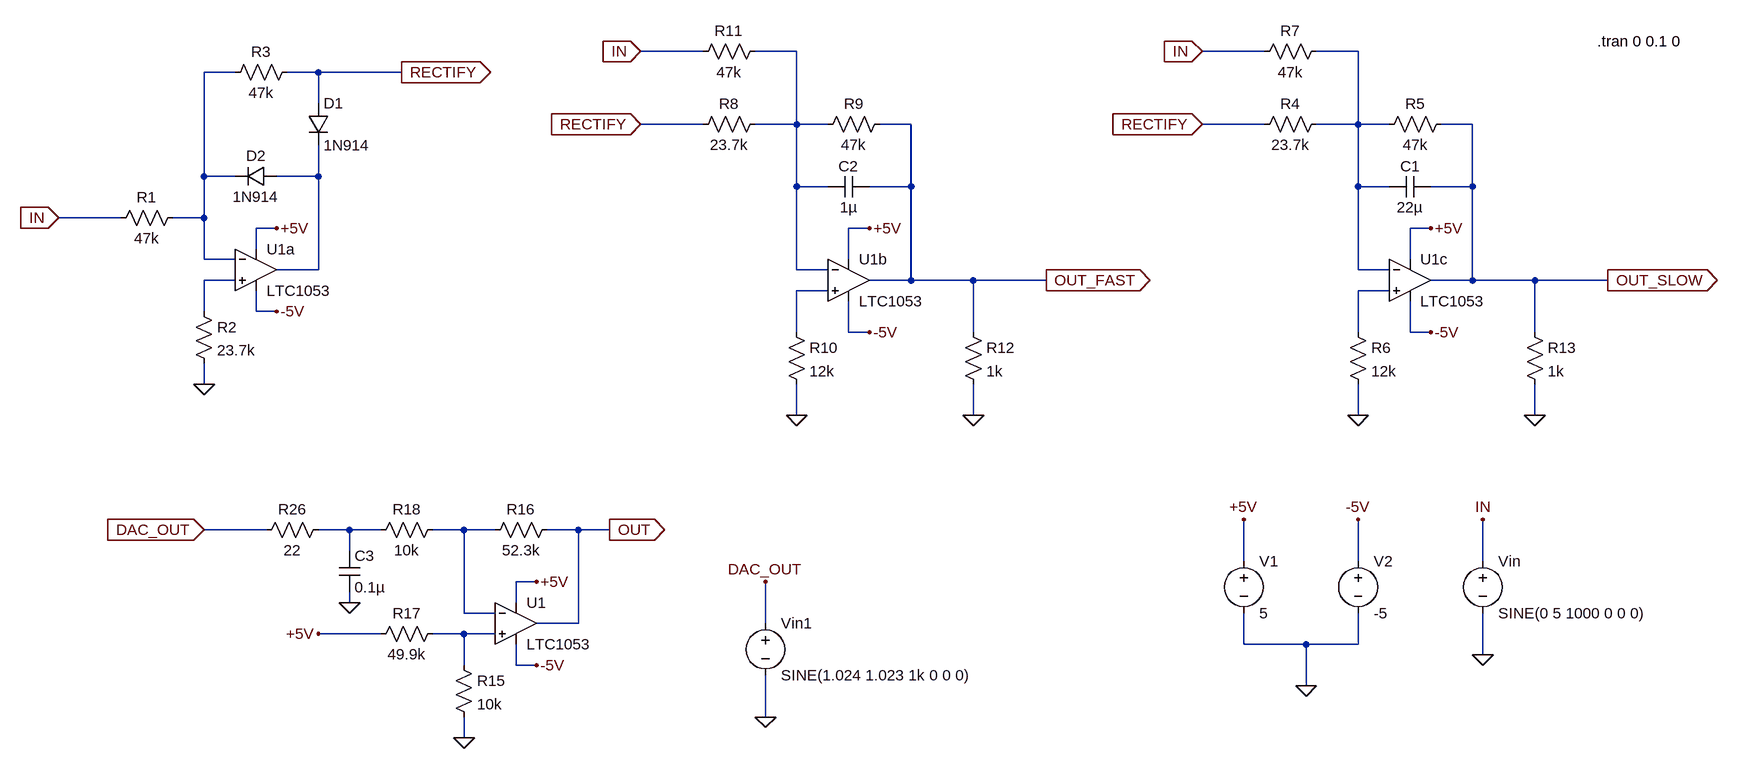
[diagram p0: schematic EE5314_Fall_2016_Project.asc]
EE5314_Fall_2016_Project.asc, the LTspice schematic file:
Version 4
SHEET 1 2136 788
WIRE -192 -336 -288 -336
WIRE -48 -336 -112 -336
WIRE 672 -336 576 -336
WIRE 816 -336 752 -336
WIRE -912 -304 -960 -304
WIRE -784 -304 -832 -304
WIRE -656 -304 -784 -304
WIRE -784 -256 -784 -304
WIRE -192 -224 -288 -224
WIRE -48 -224 -48 -336
WIRE -48 -224 -112 -224
WIRE 0 -224 -48 -224
WIRE 128 -224 80 -224
WIRE 672 -224 576 -224
WIRE 816 -224 816 -336
WIRE 816 -224 752 -224
WIRE 864 -224 816 -224
WIRE 992 -224 944 -224
WIRE -960 -144 -960 -304
WIRE -912 -144 -960 -144
WIRE -784 -144 -784 -192
WIRE -784 -144 -848 -144
WIRE -48 -128 -48 -224
WIRE 0 -128 -48 -128
WIRE 128 -128 128 -224
WIRE 128 -128 64 -128
WIRE 816 -128 816 -224
WIRE 864 -128 816 -128
WIRE 992 -128 992 -224
WIRE 992 -128 928 -128
WIRE -1088 -80 -1184 -80
WIRE -960 -80 -960 -144
WIRE -960 -80 -1008 -80
WIRE -848 -64 -880 -64
WIRE 64 -64 32 -64
WIRE 928 -64 896 -64
WIRE -880 -32 -880 -64
WIRE -960 -16 -960 -80
WIRE -912 -16 -960 -16
WIRE 32 -16 32 -64
WIRE 896 -16 896 -64
WIRE -784 0 -784 -144
WIRE -784 0 -848 0
WIRE -48 0 -48 -128
WIRE 0 0 -48 0
WIRE 816 0 816 -128
WIRE 864 0 816 0
WIRE -912 16 -960 16
WIRE 128 16 128 -128
WIRE 128 16 64 16
WIRE 224 16 128 16
WIRE 336 16 224 16
WIRE 992 16 992 -128
WIRE 992 16 928 16
WIRE 1088 16 992 16
WIRE 1200 16 1088 16
WIRE 0 32 -48 32
WIRE 864 32 816 32
WIRE -960 64 -960 16
WIRE -880 64 -880 32
WIRE -848 64 -880 64
WIRE -48 96 -48 32
WIRE 32 96 32 48
WIRE 64 96 32 96
WIRE 224 96 224 16
WIRE 816 96 816 32
WIRE 896 96 896 48
WIRE 928 96 896 96
WIRE 1088 96 1088 16
WIRE -960 176 -960 144
WIRE -48 224 -48 176
WIRE 224 224 224 176
WIRE 816 224 816 176
WIRE 1088 224 1088 176
WIRE -864 400 -960 400
WIRE -736 400 -784 400
WIRE -688 400 -736 400
WIRE -560 400 -608 400
WIRE -512 400 -560 400
WIRE -384 400 -432 400
WIRE -336 400 -384 400
WIRE -736 432 -736 400
WIRE 640 448 640 384
WIRE 816 448 816 384
WIRE 1008 448 1008 384
WIRE -448 480 -480 480
WIRE -736 512 -736 496
WIRE -480 512 -480 480
WIRE -560 528 -560 400
WIRE -512 528 -560 528
WIRE -384 544 -384 400
WIRE -384 544 -448 544
WIRE -96 544 -96 480
WIRE -688 560 -784 560
WIRE -560 560 -608 560
WIRE -512 560 -560 560
WIRE 640 576 640 528
WIRE 736 576 640 576
WIRE 816 576 816 528
WIRE 816 576 736 576
WIRE 1008 592 1008 528
WIRE -560 608 -560 560
WIRE -480 608 -480 576
WIRE -448 608 -480 608
WIRE 736 640 736 576
WIRE -96 688 -96 624
WIRE -560 720 -560 688
FLAG -1184 -80 IN
IOPIN -1184 -80 In
FLAG -960 176 0
FLAG -848 -64 +5V
FLAG -848 64 -5V
FLAG 640 384 +5V
FLAG 816 384 -5V
FLAG 736 640 0
FLAG 1008 592 0
FLAG 1008 384 IN
FLAG 336 16 OUT_FAST
IOPIN 336 16 Out
FLAG 64 -64 +5V
FLAG 64 96 -5V
FLAG -48 224 0
FLAG -288 -336 IN
IOPIN -288 -336 In
FLAG -288 -224 RECTIFY
IOPIN -288 -224 In
FLAG -656 -304 RECTIFY
IOPIN -656 -304 Out
FLAG 1200 16 OUT_SLOW
IOPIN 1200 16 Out
FLAG 928 -64 +5V
FLAG 928 96 -5V
FLAG 816 224 0
FLAG 576 -336 IN
IOPIN 576 -336 In
FLAG 576 -224 RECTIFY
IOPIN 576 -224 In
FLAG 224 224 0
FLAG 1088 224 0
FLAG -560 720 0
FLAG -448 480 +5V
FLAG -448 608 -5V
FLAG -336 400 OUT
IOPIN -336 400 Out
FLAG -96 688 0
FLAG -96 480 DAC_OUT
FLAG -784 560 +5V
FLAG -960 400 DAC_OUT
IOPIN -960 400 In
FLAG -736 512 0
SYMBOL res -992 -96 R90
WINDOW 0 0 56 VBottom 2
WINDOW 3 32 56 VTop 2
SYMATTR InstName R1
SYMATTR Value 47k
SYMBOL res -976 48 R0
SYMATTR InstName R2
SYMATTR Value 23.7k
SYMBOL diode -848 -160 R90
WINDOW 0 0 32 VBottom 2
WINDOW 3 32 32 VTop 2
SYMATTR InstName D2
SYMATTR Value 1N914
SYMBOL diode -800 -256 R0
SYMATTR InstName D1
SYMATTR Value 1N914
SYMBOL res -816 -320 R90
WINDOW 0 0 56 VBottom 2
WINDOW 3 32 56 VTop 2
SYMATTR InstName R3
SYMATTR Value 47k
SYMBOL voltage 640 432 R0
WINDOW 123 0 0 Left 2
WINDOW 39 0 0 Left 2
SYMATTR InstName V1
SYMATTR Value 5
SYMBOL voltage 816 432 R0
WINDOW 123 0 0 Left 2
WINDOW 39 0 0 Left 2
SYMATTR InstName V2
SYMATTR Value -5
SYMBOL voltage 1008 432 R0
WINDOW 39 24 117 Left 2
SYMATTR InstName Vin
SYMATTR Value SINE(0 5 1000 0 0 0)
SYMATTR Value2 AC 0 0
SYMBOL Opamps\\LTC1053 -880 -64 R0
SYMATTR InstName U1a
SYMBOL cap 64 -144 R90
WINDOW 0 0 32 VBottom 2
WINDOW 3 32 32 VTop 2
SYMATTR InstName C2
SYMATTR Value 1µ
SYMBOL res -96 -240 R90
WINDOW 0 0 56 VBottom 2
WINDOW 3 32 56 VTop 2
SYMATTR InstName R8
SYMATTR Value 23.7k
SYMBOL res 96 -240 R90
WINDOW 0 0 56 VBottom 2
WINDOW 3 32 56 VTop 2
SYMATTR InstName R9
SYMATTR Value 47k
SYMBOL res -64 80 R0
SYMATTR InstName R10
SYMATTR Value 12k
SYMBOL Opamps\\LTC1053 32 -48 R0
SYMATTR InstName U1b
SYMBOL res -96 -352 R90
WINDOW 0 0 56 VBottom 2
WINDOW 3 32 56 VTop 2
SYMATTR InstName R11
SYMATTR Value 47k
SYMBOL cap 928 -144 R90
WINDOW 0 0 32 VBottom 2
WINDOW 3 32 32 VTop 2
SYMATTR InstName C1
SYMATTR Value 22µ
SYMBOL res 768 -240 R90
WINDOW 0 0 56 VBottom 2
WINDOW 3 32 56 VTop 2
SYMATTR InstName R4
SYMATTR Value 23.7k
SYMBOL res 960 -240 R90
WINDOW 0 0 56 VBottom 2
WINDOW 3 32 56 VTop 2
SYMATTR InstName R5
SYMATTR Value 47k
SYMBOL res 800 80 R0
SYMATTR InstName R6
SYMATTR Value 12k
SYMBOL Opamps\\LTC1053 896 -48 R0
SYMATTR InstName U1c
SYMBOL res 768 -352 R90
WINDOW 0 0 56 VBottom 2
WINDOW 3 32 56 VTop 2
SYMATTR InstName R7
SYMATTR Value 47k
SYMBOL res 208 80 R0
SYMATTR InstName R12
SYMATTR Value 1k
SYMBOL res 1072 80 R0
SYMATTR InstName R13
SYMATTR Value 1k
SYMBOL res -576 592 R0
SYMATTR InstName R15
SYMATTR Value 10k
SYMBOL res -416 384 R90
WINDOW 0 0 56 VBottom 2
WINDOW 3 32 56 VTop 2
SYMATTR InstName R16
SYMATTR Value 52.3k
SYMBOL Opamps\\LTC1053 -480 480 R0
SYMATTR InstName U1
SYMBOL res -592 544 R90
WINDOW 0 0 56 VBottom 2
WINDOW 3 32 56 VTop 2
SYMATTR InstName R17
SYMATTR Value 49.9k
SYMBOL voltage -96 528 R0
WINDOW 39 24 117 Left 2
SYMATTR InstName Vin1
SYMATTR Value SINE(1.024 1.023 1k 0 0 0)
SYMATTR Value2 AC 0 0
SYMBOL res -592 384 R90
WINDOW 0 0 56 VBottom 2
WINDOW 3 32 56 VTop 2
SYMATTR InstName R18
SYMATTR Value 10k
SYMBOL res -768 384 R90
WINDOW 0 0 56 VBottom 2
WINDOW 3 32 56 VTop 2
SYMATTR InstName R26
SYMATTR Value 22
SYMBOL cap -752 432 R0
SYMATTR InstName C3
SYMATTR Value 0.1µ
TEXT 1184 -352 Left 2 !.tran 0 0.1 0

The netlist it stands for:
* EE5314_Fall_2016_Project.asc
R1 N003 IN 47k
R2 N005 0 23.7k
D2 N004 N003 1N914
D1 RECTIFY N004 1N914
R3 RECTIFY N003 47k
V1 +5V 0 5
V2 -5V 0 -5
Vin IN 0 SINE(0 5 1000 0 0 0) AC 0 0
XU1a N005 N003 +5V -5V N004 LTC1053  ; pins In+ In- V+ V- OUT
C2 OUT_FAST N001 1µ
R8 N001 RECTIFY 23.7k
R9 OUT_FAST N001 47k
R10 N006 0 12k
XU1b N006 N001 +5V -5V OUT_FAST LTC1053  ; pins In+ In- V+ V- OUT
R11 N001 IN 47k
C1 OUT_SLOW N002 22µ
R4 N002 RECTIFY 23.7k
R5 OUT_SLOW N002 47k
R6 N007 0 12k
XU1c N007 N002 +5V -5V OUT_SLOW LTC1053  ; pins In+ In- V+ V- OUT
R7 N002 IN 47k
R12 OUT_FAST 0 1k
R13 OUT_SLOW 0 1k
R15 N010 0 10k
R16 OUT N009 52.3k
XU1 N010 N009 +5V -5V OUT LTC1053  ; pins In+ In- V+ V- OUT
R17 N010 +5V 49.9k
Vin1 DAC_OUT 0 SINE(1.024 1.023 1k 0 0 0) AC 0 0
R18 N009 N008 10k
R26 N008 DAC_OUT 22
C3 N008 0 0.1µ
.model D D
.lib standard.dio
.tran 0 0.1 0
.backanno
.end